# Altium schematic sheet RT8065.SchDoc
size A4
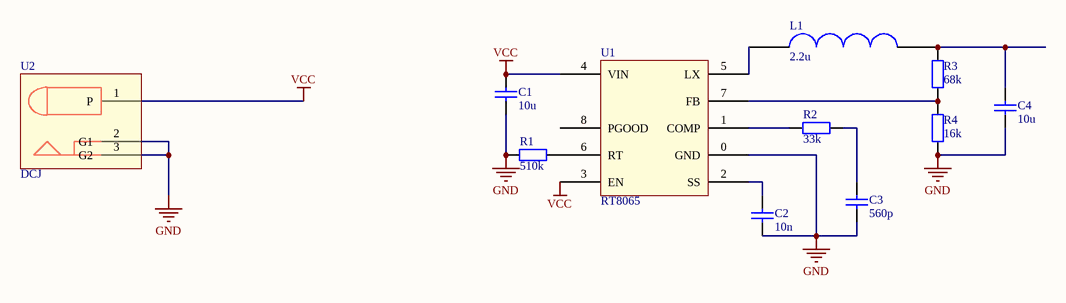
[diagram p0: RT8065.SchDoc]

## Parts
C1  10u  [0805]
C2  10n  [0805]
C3  560p  [0805]
C4  10u  [0805]
L1  2.2u  [L3X3MM]
R1  510k  [0805]
R2  33k  [0805]
R3  68k  [0805]
R4  16k  [0805]
U1  RT8065  [PSOP-8]
U2  DCJ  [JACK-2_5MM_B]

## Nets
GND: C1.1 C2.1 C3.2 C4.2 R1.1 R4.1 U1.0(GND) U2.2(G1) U2.3(G2)
VCC: C1.2 U1.3(EN) U1.4(VIN) U2.1(P)
NetC2_2: C2.2 U1.2(SS)
NetC3_1: C3.1 R2.2
NetC4_1: C4.1 L1.2 R3.2
NetL1_1: L1.1 U1.5(LX)
NetR1_2: R1.2 U1.6(RT)
NetR2_1: R2.1 U1.1(COMP)
NetR3_1: R3.1 R4.2 U1.7(FB)

Not connected (* = marked no-connect by the designer): U1 8(PGOOD)

## Library data of the parts
C1-C4 = C: Capacitor; Published: 8-Jun-2000; LatestRevisionDate: 17-Jul-2002; LatestRevisionNote: Re-released for DXP Platform.; PackageReference: RAD-0.3; Publisher: Altium Limited; PackageDescription: Radial Cap, Thru-Hole; 2 Leads; 0.3 in Pin Spacing
L1 = L
R1-R4 = R: Resistor; Published: 8-Jun-2000; LatestRevisionDate: 17-Jul-2002; LatestRevisionNote: Re-released for DXP Platform.; PackageReference: AXIAL-0.4; Publisher: Altium Limited; PackageDescription: Axial Device, Thru-Hole; 2 Leads; 0.4 in Pin Spacing